# EAGLE design Shift_register_2_IC_74595 (EAGLE 9.6.2)
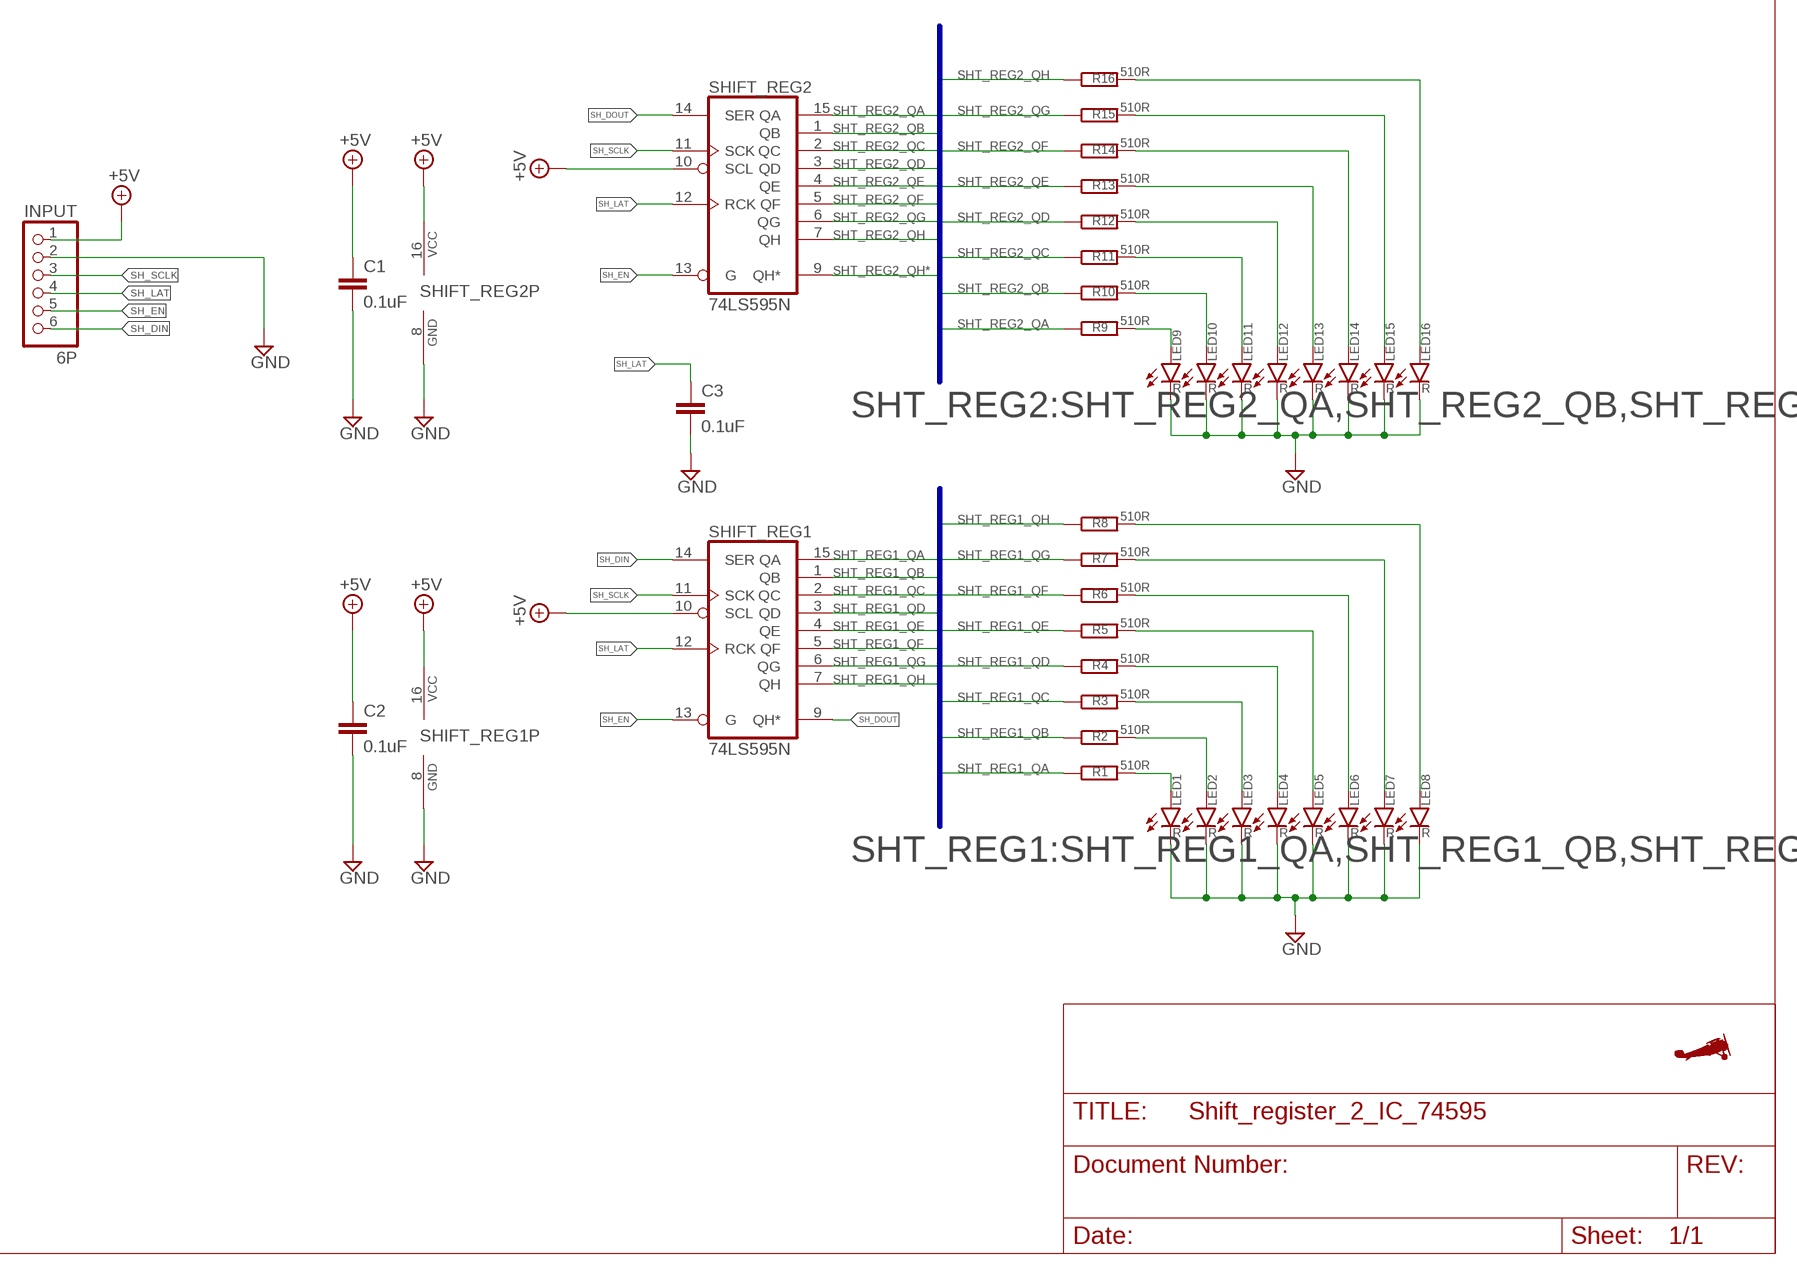
[diagram p0: schematic, sheet 1]

## Parts
C1  0.1uF  C-EU050-030X075  [C050-030X075]
C2  0.1uF  C-EU050-030X075  [C050-030X075]
C3  0.1uF  C-EU050-030X075  [C050-030X075]
INPUT  6P  PINHD-1X6/90  [1X06/90]
LED1  R  LED5MM  [LED5MM]
LED2  R  LED5MM  [LED5MM]
LED3  R  LED5MM  [LED5MM]
LED4  R  LED5MM  [LED5MM]
LED5  R  LED5MM  [LED5MM]
LED6  R  LED5MM  [LED5MM]
LED7  R  LED5MM  [LED5MM]
LED8  R  LED5MM  [LED5MM]
LED9  R  LED5MM  [LED5MM]
LED10  R  LED5MM  [LED5MM]
LED11  R  LED5MM  [LED5MM]
LED12  R  LED5MM  [LED5MM]
LED13  R  LED5MM  [LED5MM]
LED14  R  LED5MM  [LED5MM]
LED15  R  LED5MM  [LED5MM]
LED16  R  LED5MM  [LED5MM]
R1  510R  R-EU_0207/10  [0207/10]
R2  510R  R-EU_0207/10  [0207/10]
R3  510R  R-EU_0207/10  [0207/10]
R4  510R  R-EU_0207/10  [0207/10]
R5  510R  R-EU_0207/10  [0207/10]
R6  510R  R-EU_0207/10  [0207/10]
R7  510R  R-EU_0207/10  [0207/10]
R8  510R  R-EU_0207/10  [0207/10]
R9  510R  R-EU_0207/10  [0207/10]
R10  510R  R-EU_0207/10  [0207/10]
R11  510R  R-EU_0207/10  [0207/10]
R12  510R  R-EU_0207/10  [0207/10]
R13  510R  R-EU_0207/10  [0207/10]
R14  510R  R-EU_0207/10  [0207/10]
R15  510R  R-EU_0207/10  [0207/10]
R16  510R  R-EU_0207/10  [0207/10]
SHIFT_REG1  74LS595N  [DIL16]
SHIFT_REG2  74LS595N  [DIL16]
U$1  AIRPLANE  [AIRPLANE_MEDIUM]

## Nets
+5V [POWER]: C1.1 C2.1 INPUT.1 SHIFT_REG1.10(SCL) SHIFT_REG1.16(VCC) SHIFT_REG2.10(SCL) SHIFT_REG2.16(VCC)
GND [POWER]: C1.2 C2.2 C3.2 INPUT.2 LED1.K(C) LED2.K(C) LED3.K(C) LED4.K(C) LED5.K(C) LED6.K(C) LED7.K(C) LED8.K(C) LED9.K(C) LED10.K(C) LED11.K(C) LED12.K(C) LED13.K(C) LED14.K(C) LED15.K(C) LED16.K(C) SHIFT_REG1.8(GND) SHIFT_REG2.8(GND)
N$1: LED1.A R1.2
N$2: LED2.A R2.2
N$3: LED3.A R3.2
N$4: LED4.A R4.2
N$5: LED5.A R5.2
N$6: LED6.A R6.2
N$7: LED7.A R7.2
N$8: LED8.A R8.2
N$9: LED9.A R9.2
N$10: LED10.A R10.2
N$11: LED11.A R11.2
N$12: LED12.A R12.2
N$13: LED13.A R13.2
N$14: LED14.A R14.2
N$15: LED15.A R15.2
N$16: LED16.A R16.2
SH_DIN: INPUT.6 SHIFT_REG1.14(SER)
SH_DOUT: SHIFT_REG1.9(QH*) SHIFT_REG2.14(SER)
SH_EN: INPUT.5 SHIFT_REG1.13(G) SHIFT_REG2.13(G)
SH_LAT: C3.1 INPUT.4 SHIFT_REG1.12(RCK) SHIFT_REG2.12(RCK)
SH_SCLK: INPUT.3 SHIFT_REG1.11(SCK) SHIFT_REG2.11(SCK)
SHT_REG1_QA: R1.1 SHIFT_REG1.15(QA)
SHT_REG1_QB: R2.1 SHIFT_REG1.1(QB)
SHT_REG1_QC: R3.1 SHIFT_REG1.2(QC)
SHT_REG1_QD: R4.1 SHIFT_REG1.3(QD)
SHT_REG1_QE: R5.1 SHIFT_REG1.4(QE)
SHT_REG1_QF: R6.1 SHIFT_REG1.5(QF)
SHT_REG1_QG: R7.1 SHIFT_REG1.6(QG)
SHT_REG1_QH: R8.1 SHIFT_REG1.7(QH)
SHT_REG2_QA: R9.1 SHIFT_REG2.15(QA)
SHT_REG2_QB: R10.1 SHIFT_REG2.1(QB)
SHT_REG2_QC: R11.1 SHIFT_REG2.2(QC)
SHT_REG2_QD: R12.1 SHIFT_REG2.3(QD)
SHT_REG2_QE: R13.1 SHIFT_REG2.4(QE)
SHT_REG2_QF: R14.1 SHIFT_REG2.5(QF)
SHT_REG2_QG: R15.1 SHIFT_REG2.6(QG)
SHT_REG2_QH: R16.1 SHIFT_REG2.7(QH)
SHT_REG2_QH*: SHIFT_REG2.9(QH*)

## Buses
SHT_REG1:SHT_REG1_QA,SHT_REG1_QB,SHT_REG1_QC,SHT_REG1_QD,SHT_REG1_QE,SHT_REG1_QF,SHT_REG1_QG,SHT_REG1_QH,SHT_REG1_QH*
SHT_REG2:SHT_REG2_QA,SHT_REG2_QB,SHT_REG2_QC,SHT_REG2_QD,SHT_REG2_QE,SHT_REG2_QF,SHT_REG2_QG,SHT_REG2_QH,SHT_REG2_QH*

## Library data of the parts
C1-C3 = rcl:C-EU: CAPACITOR, European symbol; SPICEPREFIX: C
INPUT = pinhead:PINHD-1X6: PIN HEADER
LED1-LED16 = led:LED: LED OSRAM: - CHIPLED LG R971, LG N971, LY N971, LG Q971, LY Q971, LO R971, LY R971 LH N974, LH R974 LS Q976, LO Q976, LY Q976 LO Q996 - Hyper CHIPLED LW Q18S LB Q993, LB Q99A, LB R99A - SideLED LS A670, LO A670, LY A670, LG A670, LP A670 LB A673, LV A673, LT A673, LW A673 LH A674 LY A675 LS A676, LA A676, LO A676, LY A676, LW A676 LS A679, LY A679, LG A679 - Hyper Micro SIDELED® LS Y876, LA Y876, LO Y876, LY Y876 LT Y87S - SmartLED LW L88C, LW L88S LB L89C, LB L89S, LG L890 LS L89K, LO L89K, LY L89K LS L896, LA L896, LO L896, LY L896 - TOPLED LS T670, LO T670, LY T670, LG T670, LP T670 LSG T670, LSP T670, LSY T670, LOP T670, LYG T670 LG T671, LOG T671, LSG T671 LB T673, LV T673, LT T673, LW T673 LH T674 LS T676, LA T676, LO T676, LY T676, LB T676, LH T676, LSB T676, LW T676 LB T67C, LV T67C, LT T67C, LS T67K, LO T67K, LY T67K, LW E67C LS E67B, LA E67B, LO E67B, LY E67B, LB E67C, LV E67C, LT E67C LW T67C LS T679, LY T679, LG T679 LS T770, LO T770, LY T770, LG T770, LP T770 LB T773, LV T773, LT T773, LW T773 LH T774 LS E675, LA E675, LY E675, LS T675 LS T776, LA T776, LO T776, LY T776, LB T776 LHGB T686 LT T68C, LB T68C - Hyper Mini TOPLED® LB M676 - Mini TOPLED Santana® LG M470 LS M47K, LO M47K, LY M47K Source: http://www.osram.convergy.de LUXEON: - LUMILED® LXK2-PW12-R00, LXK2-PW12-S00, LXK2-PW14-U00, LXK2-PW14-V00 LXK2-PM12-R00, LXK2-PM12-S00, LXK2-PM14-U00 LXK2-PE12-Q00, LXK2-PE12-R00, LXK2-PE12-S00, LXK2-PE14-T00, LXK2-PE14-U00 LXK2-PB12-K00, LXK2-PB12-L00, LXK2-PB12-M00, LXK2-PB14-N00, LXK2-PB14-P00, LXK2-PB14-Q00 LXK2-PR12-L00, LXK2-PR12-M00, LXK2-PR14-Q00, LXK2-PR14-R00 LXK2-PD12-Q00, LXK2-PD12-R00, LXK2-PD12-S00 LXK2-PH12-R00, LXK2-PH12-S00 LXK2-PL12-P00, LXK2-PL12-Q00, LXK2-PL12-R00 Source: www.luxeon.com KINGBRIGHT: KA-3528ASYC Source: www.kingbright.com
R1-R16 = rcl:R-EU_: RESISTOR, European symbol; SPICEPREFIX: R
SHIFT_REG1 SHIFT_REG2 = 74xx-us:74*595: 8-bit SHIFT REGISTER, output latch
U$1 = AT25SF321:AIRPLANE: Airplane Logo 16*8mm

## Net classes
0 default: width 0.254 mm, drill 0.406 mm, clearance 0.305 mm
1 POWER: width 0.406 mm, drill 0.406 mm, clearance 0.305 mm

## Board
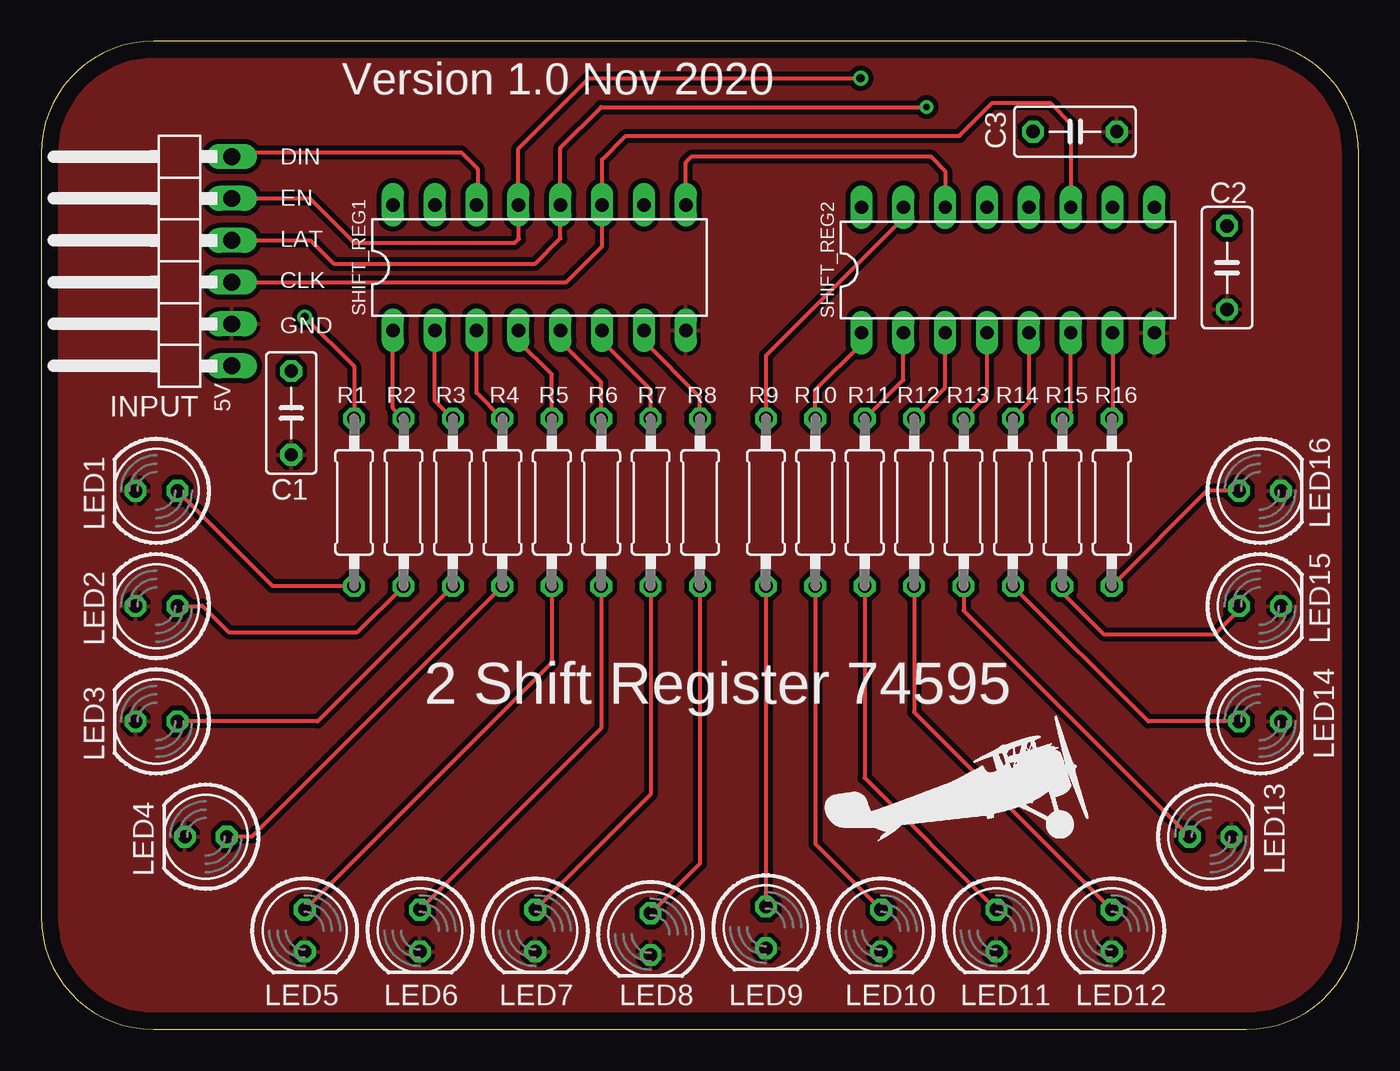
[diagram p1: board, top side]
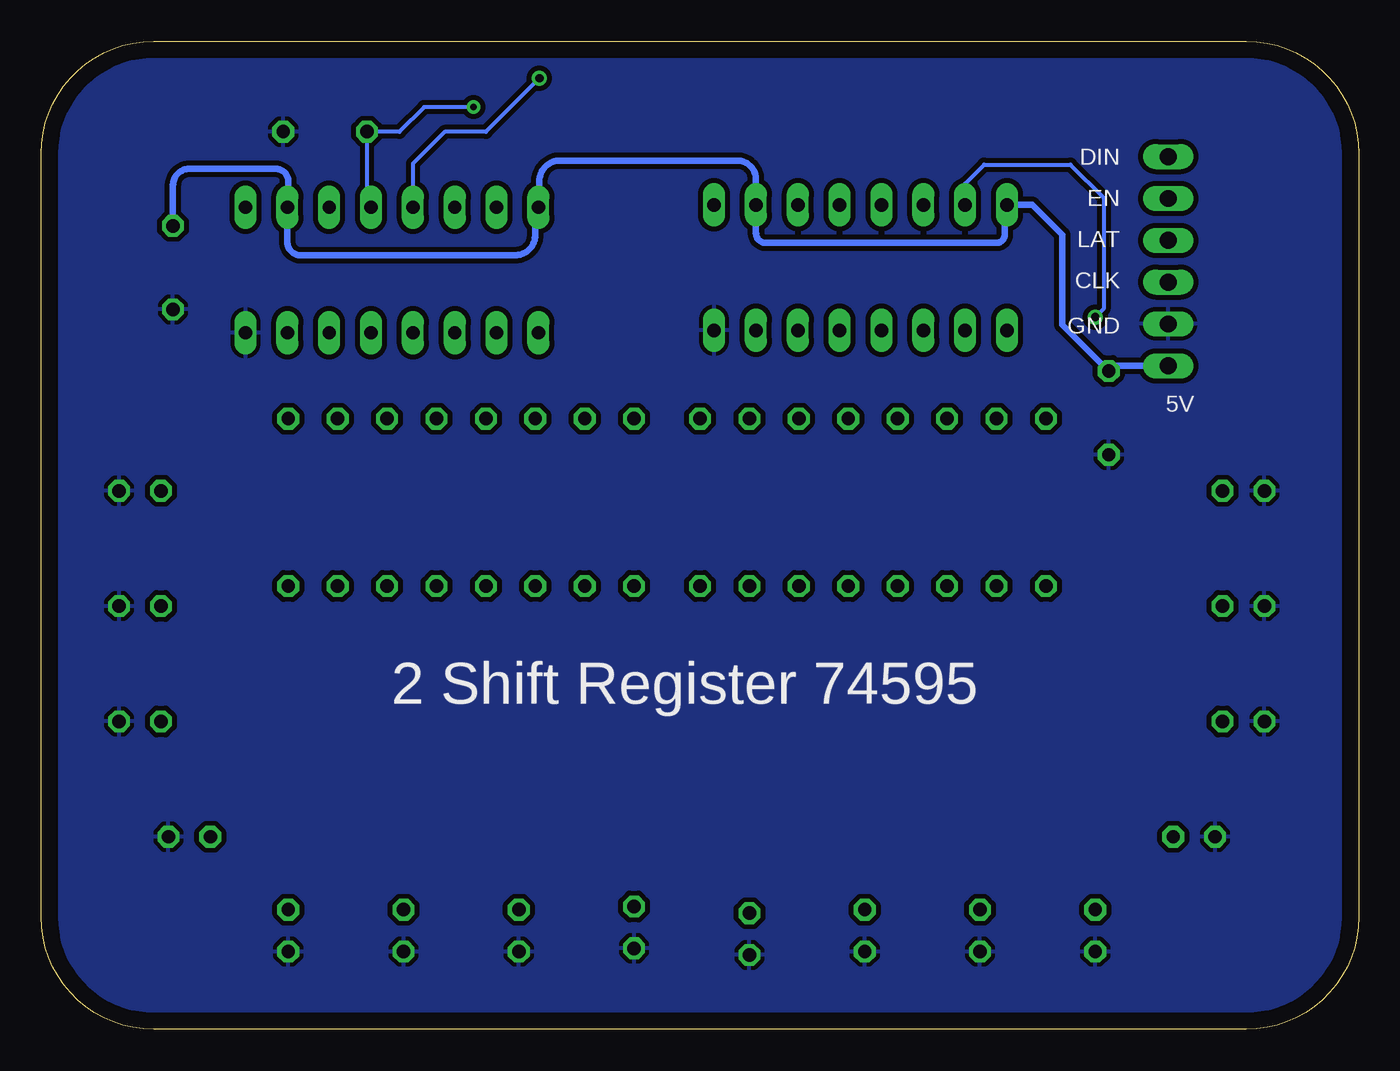
[diagram p2: board, bottom side, seen from below]

Size 80 x 60 mm. Coordinates in mm from the lower left corner, seen from the top.
Outline: 0,53.17 0,6.83 arc90 6.83,0 73.17,0 arc90 80,6.83 80,53.17 arc90 73.17,60 6.83,60 arc90 0,53.17
Copper layers (1*16): Top 0.035mm / dielectric 1.5mm / Bottom 0.035mm
Design rules "default *": minimum track width 8mil, minimum drill 0.35mm, track to track 8mil, track to pad 8mil, pad to pad 8mil, via to via 8mil, smd to smd 8mil, copper to edge 40mil, drill to drill 6mil, minimum pad ring 10mil, minimum via ring 8mil, stop-mask expansion 4mil, vias tented up to drill 0mil, thermal gap 10mil

### Footprints (pad centres in the part's own frame; a part is rotated, then mirrored left to right if it is on the bottom)
C050-030X075 = drill 0.813 octagon: 1 -2.54,0; 2 2.54,0
1X06/90 = drill 1.016 long: 1 -6.35,-3.81; 2 -3.81,-3.81; 3 -1.27,-3.81; 4 1.27,-3.81; 5 3.81,-3.81; 6 6.35,-3.81
LED5MM = drill 0.813 octagon: A -1.27,0; K 1.27,0
0207/10 = drill 0.813 octagon: 1 -5.08,0; 2 5.08,0
DIL16 = drill 0.813 long: 1 -8.89,-3.81; 2 -6.35,-3.81; 3 -3.81,-3.81; 4 -1.27,-3.81; 5 1.27,-3.81; 6 3.81,-3.81; 7 6.35,-3.81; 8 8.89,-3.81; 9 8.89,3.81; 10 6.35,3.81; 11 3.81,3.81; 12 1.27,3.81; 13 -1.27,3.81; 14 -3.81,3.81; 15 -6.35,3.81; 16 -8.89,3.81

### Placement (x,y rotation side)
C1  15.19,37.43 270 top
C2  72,46.25 270 top
C3  62.76,54.51 0 top
INPUT  7.76,46.64 90 top
LED1  7,32.7 180 top
LED2  7,25.7 180 top
LED3  7,18.7 180 top
LED4  10,11.7 180 top
LED5  16,6 270 top
LED6  23,6 270 top
LED7  30,6 270 top
LED8  37,5.79 270 top
LED9  44,6.19 270 top
LED10  51,6 270 top
LED11  58,6 270 top
LED12  65,6 270 top
LED13  71,11.7 0 top
LED14  74,18.7 0 top
LED15  74,25.7 0 top
LED16  74,32.7 0 top
R1  19,32 270 top
R2  22,32 270 top
R3  25,32 270 top
R4  28,32 270 top
R5  31,32 270 top
R6  34,32 270 top
R7  37,32 270 top
R8  40,32 270 top
R9  44,32 270 top
R10  47,32 270 top
R11  50,32 270 top
R12  53,32 270 top
R13  56,32 270 top
R14  59,32 270 top
R15  62,32 270 top
R16  65,32 270 top
SHIFT_REG1  30.25,46.25 0 top
SHIFT_REG2  58.7,46.11 0 top
U$1  55.5,11.25 0 top

### Tracks (layer width: path | path; a pad name or v marks a point on that pad's centre or on a via)
+5V
  Bottom 0.406: INPUT.1 14.86,40.29 C1.1 18,42.78 18,48.25 19.81,50.06 SHIFT_REG1.16 arc-90 21.5,49.92 21.5,48.25 arc90 22,47.75 36,47.75 arc90 36.6,48.35 SHIFT_REG1.10 36.6,51.6 arc-90 37.75,52.75 48.5,52.75 arc-90 49.75,51.5 49.75,49.98 arc90 SHIFT_REG2.16 arc-90 50,49.73 50,48.25 arc90 51.25,47 64.25,47 arc90 65.05,47.8 SHIFT_REG2.10 arc-90 65,49.97 65,51.5 arc-90 65.75,52.25 71,52.25 arc-90 72,51.25 C2.1
GND
  pour Top (isolate 0.254): 6.5,60 73.25,60 73.5,60 arc-90 80,53.5 80,7 80,6.75 arc-90 73.25,0 7,0 6.5,0 arc-90 0,6.5 0,53.25 0,53.5 arc-90
  pour Bottom: 6.5,60 73.25,60 73.5,60 arc-90 80,53.5 80,7 80,6.75 arc-90 73.25,0 7,0 6.5,0 arc-90 0,6.5 0,53.25 0,53.5 arc-90
N$1
  Top 0.254: R1.2 14.05,26.92 LED1.A
N$2
  Top 0.254: LED2.A 9.7,25.7 9.75,25.75 11.38,24.12 19.2,24.12 R2.2
N$3
  Top 0.254: R3.2 16.78,18.7 LED3.A
N$4
  Top 0.254: R4.2 12.78,11.7 LED4.A
N$5
  Top 0.254: R5.2 31,22.27 LED5.A
N$6
  Top 0.254: R6.2 34,18.27 LED6.A
N$7
  Top 0.254: R7.2 37,14.27 LED7.A
N$8
  Top 0.254: R8.2 40,10.06 LED8.A
N$9
  Top 0.254: R9.2 LED9.A
N$10
  Top 0.254: R10.2 47,11.27 LED10.A
N$11
  Top 0.254: R11.2 50,15.27 LED11.A
N$12
  Top 0.254: R12.2 53,19.27 LED12.A
N$13
  Top 0.254: R13.2 56,25.43 LED13.A
N$14
  Top 0.254: LED14.A 67.22,18.7 R14.2
N$15
  Top 0.254: R15.2 62,26.5 64.5,24 71.25,24 72.73,25.48 LED15.A
N$16
  Top 0.254: LED16.A 70.78,32.7 R16.2
SH_DIN
  Top 0.254: INPUT.6 11.83,53.25 25.5,53.25 26.5,52.25 26.5,50.12 SHIFT_REG1.14
SH_DOUT
  Top 0.254: SHIFT_REG1.9 39.14,52.64 39.5,53 54,53 54.89,52.11 SHIFT_REG2.14
SH_EN  (via drill 0.5)
  Top 0.254: INPUT.5 16.3,50.45 19,47.75 28.75,47.75 29,48 29,50.04 SHIFT_REG1.13 28.98,53.48 33.25,57.75 v49.75,57.75
  Bottom 0.254: v49.75,57.75 53,54.5 55.5,54.5 57.43,52.57 SHIFT_REG2.13
SH_LAT  (via drill 0.41)
  Top 0.254: INPUT.4 16.34,47.91 17.75,46.5 30,46.5 31.52,48.02 SHIFT_REG1.12 31.52,53.52 34,56 v53.75,56
  Bottom 0.254: SHIFT_REG2.12 60.22,50.17 C3.1 58.25,54.5 56.75,56 v53.75,56
SH_SCLK
  Top 0.254: INPUT.3 31.87,45.37 34.06,47.56 SHIFT_REG1.11 34.06,52.81 35.5,54.25 55.75,54.25 57.75,56.25 61.25,56.25 62.51,54.99 SHIFT_REG2.11
SHT_REG1_QA  (via drill 0.5)
  Top 0.254: v16,43.25 19,40.25 R1.1
  Bottom 0.254: SHIFT_REG1.15 23.9,51.35 22.75,52.5 17.51,52.5 15.5,50.49 15.5,43.75 v16,43.25
SHT_REG1_QB
  Top 0.254: R2.1 21.36,37.72 21.36,41.78 SHIFT_REG1.1
SHT_REG1_QC
  Top 0.254: R3.1 23.9,38.18 23.9,41.78 SHIFT_REG1.2
SHT_REG1_QD
  Top 0.254: R4.1 26.44,38.64 26.44,41.78 SHIFT_REG1.3
SHT_REG1_QE
  Top 0.254: R5.1 31,39.76 28.98,41.78 SHIFT_REG1.4
SHT_REG1_QF
  Top 0.254: R6.1 34,39.3 31.52,41.78 SHIFT_REG1.5
SHT_REG1_QG
  Top 0.254: R7.1 37,38.84 34.06,41.78 SHIFT_REG1.6
SHT_REG1_QH
  Top 0.254: R8.1 40,38.38 36.6,41.78 SHIFT_REG1.7
SHT_REG2_QA
  Top 0.254: R9.1 44,40.91 52.35,49.26 SHIFT_REG2.15
SHT_REG2_QB
  Top 0.254: R10.1 47,38.83 49.81,41.64 SHIFT_REG2.1
SHT_REG2_QC
  Top 0.254: R11.1 52.35,39.43 52.35,41.64 SHIFT_REG2.2
SHT_REG2_QD
  Top 0.254: R12.1 54.89,38.97 54.89,41.64 SHIFT_REG2.3
SHT_REG2_QE
  Top 0.254: R13.1 57.43,38.51 57.43,41.64 SHIFT_REG2.4
SHT_REG2_QF
  Top 0.254: SHIFT_REG2.5 59.97,38.05 R14.1
SHT_REG2_QG
  Top 0.254: R15.1 62.51,37.59 62.51,41.64 SHIFT_REG2.6
SHT_REG2_QH
  Top 0.254: R16.1 65.05,37.13 SHIFT_REG2.7

### Text on the board
tNames: Version 1.0 Nov 2020 | DIN | EN | LAT | CLK | GND | 5V | 2 Shift Register 74595
bNames: DIN | EN | LAT | CLK | GND | 5V | 2 Shift Register 74595